# Altium schematic sheet Peripherals.SchDoc
size A; SheetNumber: 2; SheetTotal: 2
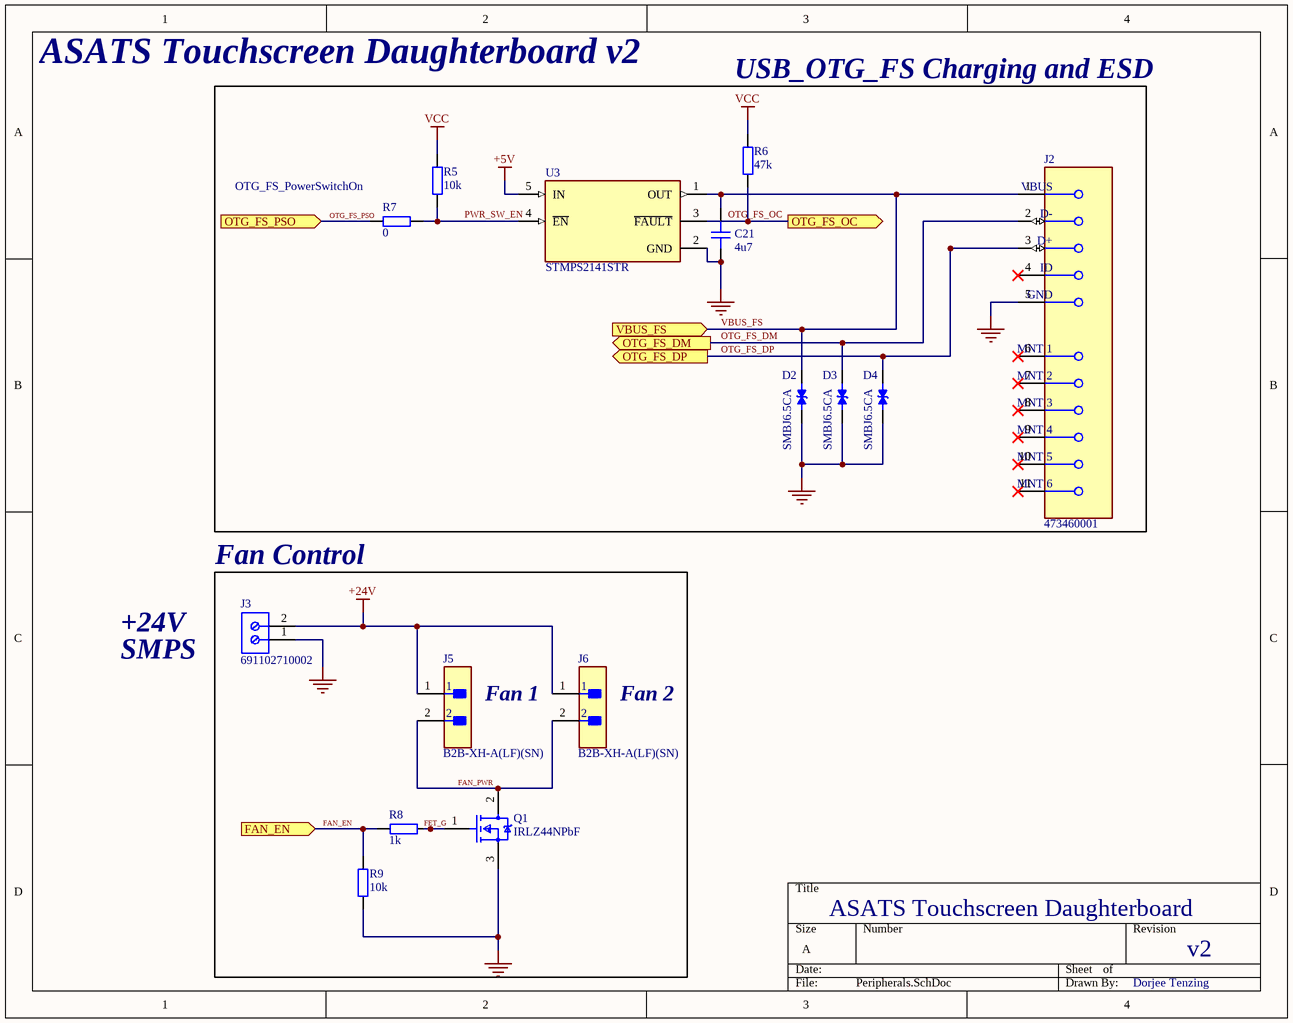
[diagram p0: Peripherals.SchDoc]

## Parts
C21  4u7  [CAP_0603]
D2  SMBJ6.5CA  [DIOM4336X265N]
D3  SMBJ6.5CA  [DIOM4336X265N]
D4  SMBJ6.5CA  [DIOM4336X265N]
J2  473460001  [FP-473460001-MFG]
J3  691102710002  [691102710002]
J5  B2B-XH-A(LF)(SN)  [FP-B2B-XH-A_LF_SN-MFG]
J6  B2B-XH-A(LF)(SN)  [FP-B2B-XH-A_LF_SN-MFG]
Q1  IRLZ44NPbF  [FP-PG-TO220-3-MFG]
R5  10k  [RES_0402]
R6  47k  [RES_0402]
R7  0  [RES_0402]
R8  1k  [RES_0402]
R9  10k  [RES_0402]
U3  STMPS2141STR  [FP-SOT23-5L-MFG]

## Blocks framed on the sheet
USB_OTG_FS Charging and ESD: C21 D2-D4 J2 R5-R7 U3
Fan Control: J3 J5 J6 Q1 R8 R9

## Ports
FAN_EN (in), OTG_FS_DM (out), OTG_FS_DP (out), OTG_FS_OC (out), OTG_FS_PSO (in), VBUS_FS (in)

## Nets
+5V: U3.5(IN)
+24V: J3.2 J5.1 J6.1
GND: C21.1 D2.1 D3.1 D4.1 J2.5(GND) J3.1 Q1.3(S) R9.1 U3.2(GND)
VCC: R5.2 R6.2
FAN_EN: R8.1 R9.2 ; port FAN_EN
FAN_PWR: J5.2 J6.2 Q1.2(D)
FET_G: Q1.1(G) R8.2
OTG_FS_DM: D3.2 J2.2(D-) ; port OTG_FS_DM
OTG_FS_DP: D4.2 J2.3(D+) ; port OTG_FS_DP
OTG_FS_OC: R6.1 U3.3(~{FAULT}) ; port OTG_FS_OC
OTG_FS_PSO: R7.1 ; port OTG_FS_PSO
PWR_SW_EN: R5.1 R7.2 U3.4(~{EN})
VBUS_FS: C21.2 D2.2 J2.1(VBUS) U3.1(OUT) ; port VBUS_FS

Not connected (* = marked no-connect by the designer): J2 4(ID)* 6(MNT_1)* 7(MNT_2)* 8(MNT_3)* 9(MNT_4)* 10(MNT_5)* 11(MNT_6)*

## Notes on the sheet
- ASATS Touchscreen Daughterboard v2
- (near R7) OTG_FS_PowerSwitchOn
- +24V
- SMPS
- Fan 1
- (near J6) Fan 2
- ASATS Touchscreen Daughterboard
- v2
- Dorjee Tenzing

## Library data of the parts
C21 = CAP_0603: Capacitor SMD 0603; Manufacturer: Samsung Electro-Mechanics; Manufacturer Part Number: CL10A475KO8NNNC; Rating: 16V; Distributor Link: *; LCSC: C19666; Dielectric: *
D2-D4 = SMBJ6.5CA: 53.57A 600W 11.2V 7.22V Bidirectional 6.5V SMB  ESD and Surge Protection (TVS/ESD) ROHS; Manufacturer: hongjiacheng; Manufacturer Part Number: SMBJ6.5CA; LCSC: C7420377
J2 = CMP-2000-05246-2: CONN RCPT USB2.0 MICRO B SMD R/A; Manufacturer: Molex; Conn Orientation: Right Angle; Is Female: yes; Shielding: true; Pitch: 0.65mm; Number Of Contacts: 5; Voltage Rating: 30V; Current Rating: 1.8A; Device Class L2: USB Connectors; Digikey Description: CONN RCPT USB2.0 MICRO B SMD R/A; Height: 2.945mm; RoHS: TRUE; ComponentLink2Description: Datasheet; Octopart: https://octopart.com/47346-0001-molex-7164928; Automotive: No; Package: 0; Category: Conn; Device Class L1: Connectors; Usb Standard: USB 2.0; Temperature: -30°C to +85°C; Temperature Range Low: -30°C; Footprint Url: https://www.molex.com/pdm_docs/sd/473460001_sd.pdf; ComponentLink2URL: https://www.molex.com/webdocs/datasheets/pdf/en-us/0473460001_IO_CONNECTORS.pdf; Lead Free: Yes; Manufacturer Part Number: 473460001; Contact Material: Gold,Nickel; Temperature Range High: +85°C; Device Class L3: unset; LCSC: C132560
J3 = CMP-1502-03258-2: NexarPartId: 8917706; Number of Levels: 1; Number of Positions Per Level: 2; Current: 15A; Voltage: 300V; Pitch: 5.0038mm; Plating: Steel; Stripping Length: -6mm; Wire Gauge (Min): 14AWG; Wire Gauge (Max): 22AWG; Length: 7.5mm; Contact Material: Brass; Contact Plating: Tin; Packaging: Box; Number of Pins: 2; Voltage Rating: 300V; Termination: Screw; Number of Contacts: 2; Color: Blue; Current Rating: 15A; Mount: Through Hole; Max Operating Temperature: 105°C; Min Operating Temperature: -40°C; REACH SVHC: Unknown; Height: 13.4mm; Width: 11.2mm; Housing Material: Nylon; RoHS: Compliant; Wire/Cable Gauge: 22AWG; Lead Pitch: 5mm
J5 J6 = CMP-2000-05888-3: CONN HEADER VERT 2POS 2.5MM; Current Rating: 3A; Voltage Rating: 250V; Number of Contacts: 2; Contact Resistance: 20mR; Wire/Cable Gauge: 22AWG; Insulation Resistance: 1GR; Connector Type: Male Pin; Packaging: Bulk; Contact Material: Brass; Lead Free: Lead Free; Orientation: Straight; Contact Plating: Tin; Max Current Rating: 3A; Termination: Solder; Fastening Type: Detent; Depth: 5.75mm; Housing Material: Polyamide; REACH SVHC: No SVHC; Series: XH; Voltage Rating (AC): 250V; Number of Positions: 2; Color: Natural; Contact Type: Male Pin; Max Voltage Rating (DC): 250V; Pitch: 2.5mm; Lead Pitch: 2.5mm; Mount: Through Hole; Max Operating Temperature: 85°C; Length: 7.4mm; Max Voltage Rating (AC): 250V; Min Operating Temperature: -25°C; Number of Rows: 1; Housing Color: White
Q1 = CMP-32901-000488-1: MOSFET N-CH 55V 47A TO220AB; Turn-On Delay Time: 11ns; Gate to Source Voltage (Vgs): 16V; Element Configuration: Single; Rds On Max: 22mR; Turn-Off Delay Time: 26ns; Max Power Dissipation: 110W; Threshold Voltage: 2V; Drain to Source Resistance: 35mR; Input Capacitance: 1.7nF; Continuous Drain Current (ID): 47A; Case/Package: TO-220; Lead Free: Lead Free; Halogen Free: Halogen Free; Packaging: Rail/Tube; Length: 0.414inch; Min Operating Temperature: -55°C; REACH SVHC: No SVHC; Number of Pins: 3; Width: 0.185inch; Drain to Source Voltage (Vdss): 55V; Power Dissipation: 110W; RoHS Compliant: Yes; Max Operating Temperature: 175°C; Height: 0.6inch; Max Dual Supply Voltage: 55V; Drain to Source Breakdown Voltage: 55V; Mount: Through Hole
R5 R9 = RES_0402: Resistor SMD 0402; Manufacturer: UNI-ROYAL(Uniroyal Elec); Manufacturer Part Number: 0402WGF1002TCE; Distributor Link: *; LCSC: C25744
R6 = RES_0402: Resistor SMD 0402; Manufacturer: UNI-ROYAL(Uniroyal Elec); Manufacturer Part Number: 0402WGF4702TCE; Distributor Link: *; LCSC: C25792
R7 = RES_0402: Resistor SMD 0402; Manufacturer: UNI-ROYAL(Uniroyal Elec); Manufacturer Part Number: 0402WGF0000TCE; Distributor Link: *; LCSC: C17168
R8 = RES_0402: Resistor SMD 0402; Manufacturer: UNI-ROYAL(Uniroyal Elec); Manufacturer Part Number: 0402WGF1001TCE; Distributor Link: *; LCSC: C11702
U3 = CMP-00355-07169648-1: STMPS2141STR STMPS Series 1 Channel 5.5 V 500 mA 200 mOhm High Side Power Switch - SOT-23-5; Manufacturer: STMicroelectronics; Max Junction Temperature (Tj): 125°C; Output Current: 0A; Voltage: 5.5V; Interface: On/Off; Nominal Input Voltage: 5V; Current Rating: 500mA; Drain to Source Resistance: 90mΩ; Turn-Off Delay Time: 10ms; Number of Outputs: 1; Fault Protection: Over Temperature, Reverse Current; Nominal Supply Current: 40µA; Power Dissipation: 32.5mW; Resistance: 120mΩ; Turn-On Delay Time: 5ms; Min Input Voltage: 2.7V; Radiation Hardening: No; Output Configuration: High Side; Length: 3mm; Packaging: Tape & Reel (TR); Lifecycle Status: Production; Max Input Voltage: 5.5V; Number of Inputs: 1; Max Supply Voltage: 5.5V; Max Operating Temperature: 85°C; Ambient Temperature Range High: 85°C; Min Operating Temperature: -40°C; Operating Supply Voltage: 5.5V; RoHS: Compliant; Width: 1.75mm; Max Power Dissipation: 32.5mW; Number of Channels: 1; Output Voltage: 5V; Mount: Surface Mount; Case/Package: SOT-23-5; Max Supply Current: 40µA; NexarPartId: 7169648; Min Supply Voltage: 2.7V; Number of Pins: 5; Current: 500mA; Lead Free: Lead Free; Max Output Current: 500mA; Height: 1.3mm; Schedule B: 8542390000; Manufacturer Part Number: STMPS2141STR; LCSC: C54624